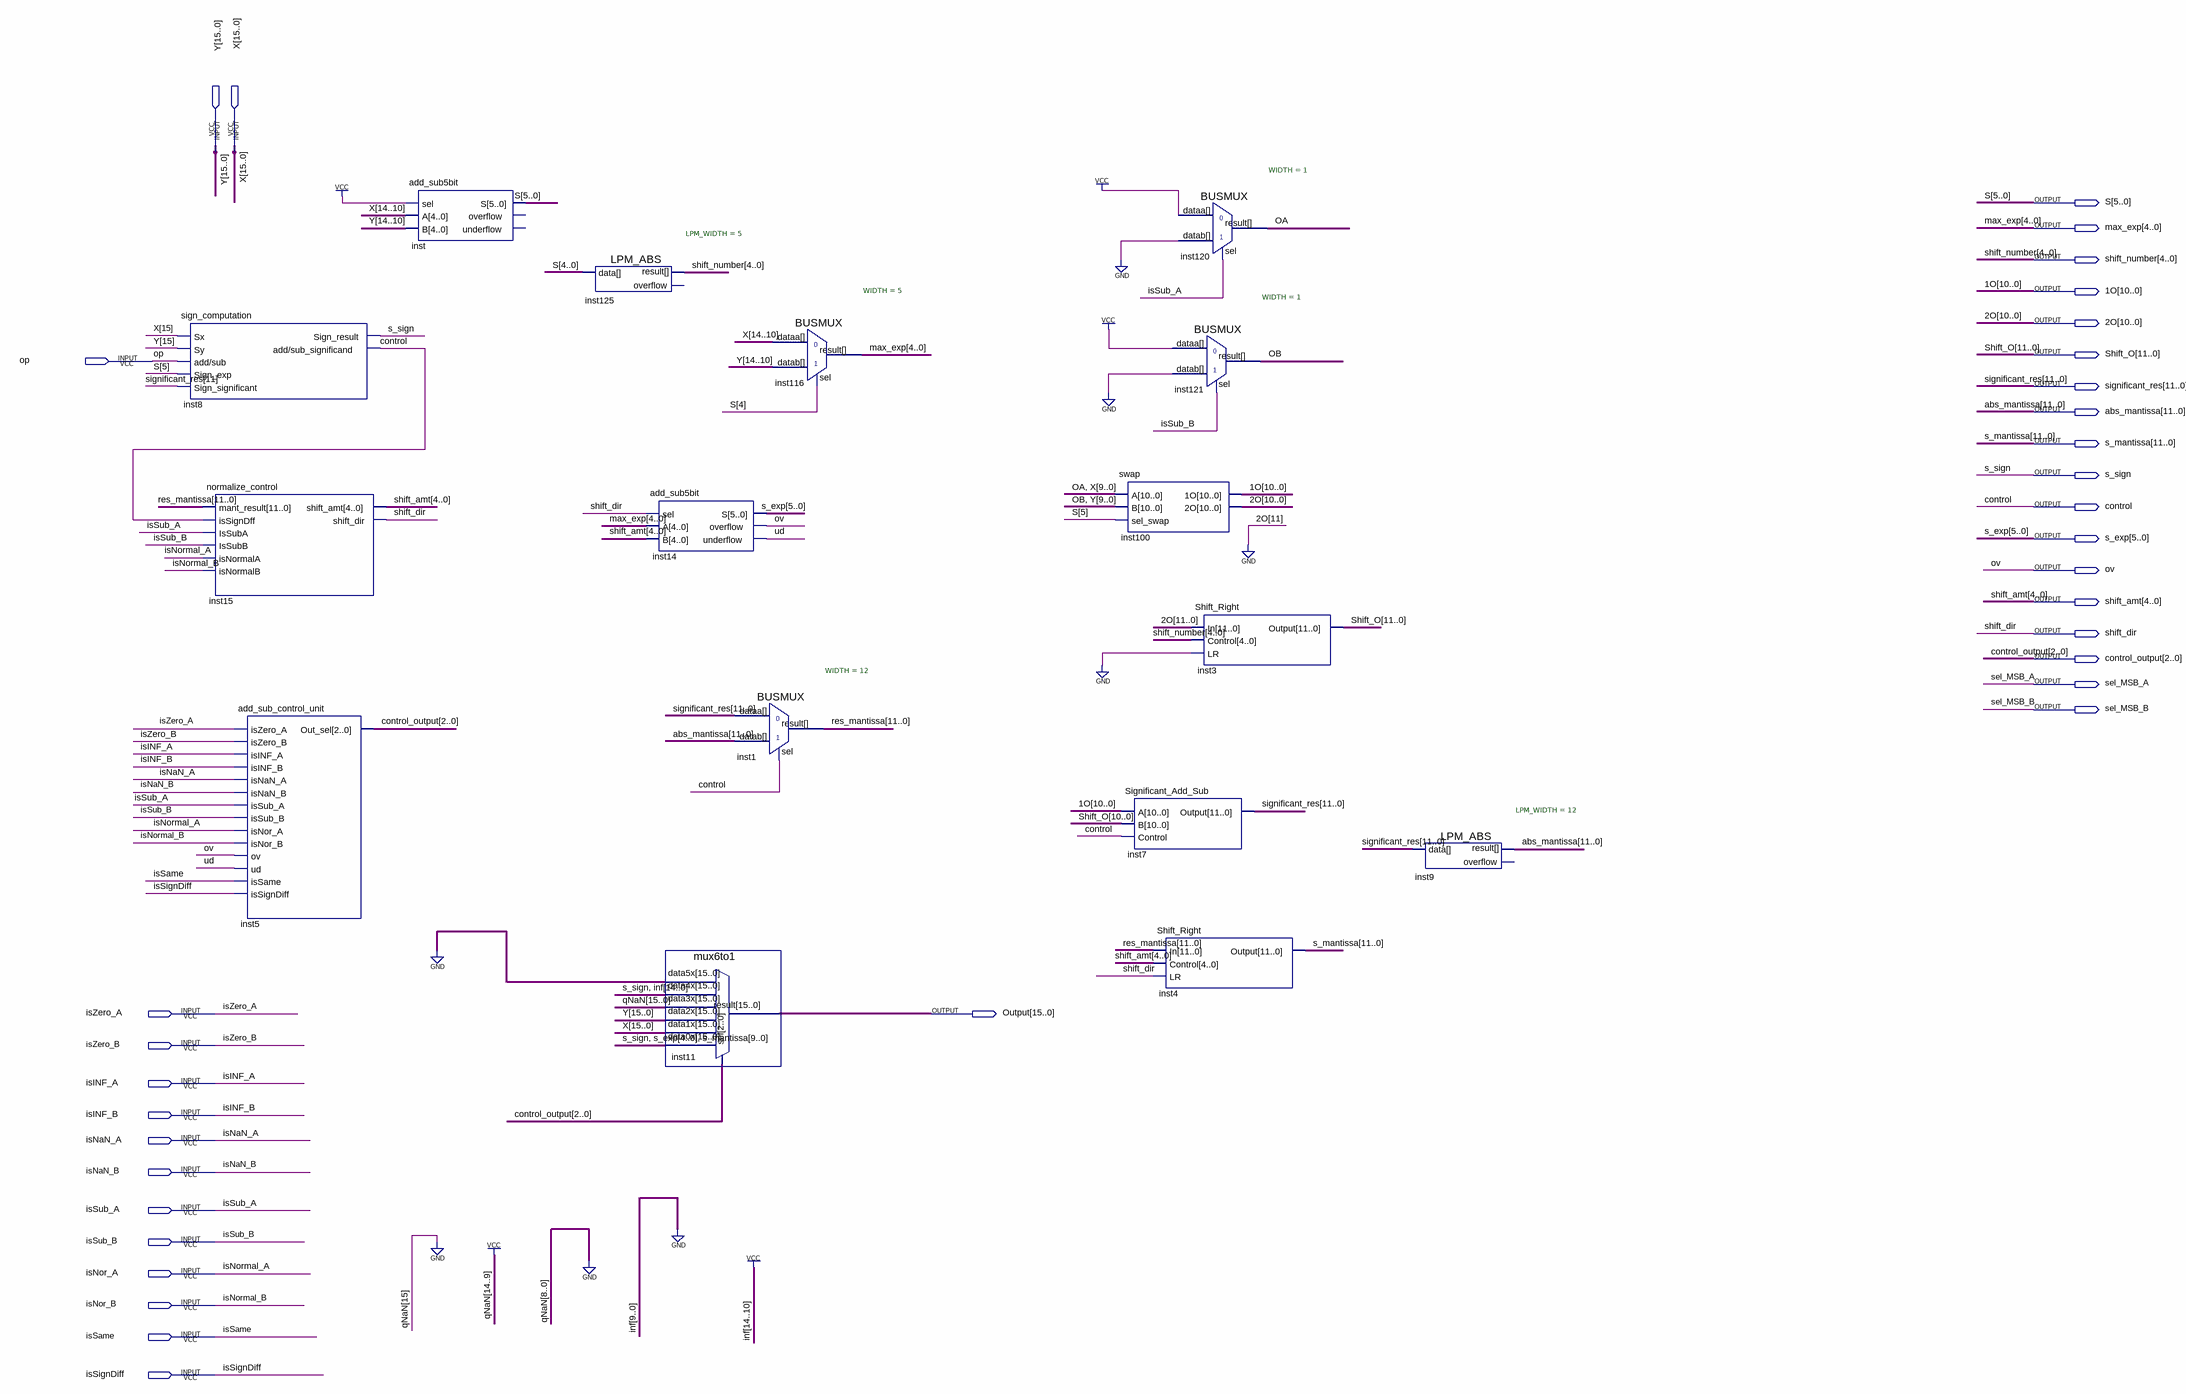
[diagram p0: schematic sheet]
// Quartus schematic FPU.bdf as structural Verilog: 16 symbols, 34 pins
module FPU (
  input  [15:0] Y,
  input  [15:0] X,
  input  op,
  input  isZero_A,
  input  isZero_B,
  input  isINF_A,
  input  isINF_B,
  input  isNaN_A,
  input  isNaN_B,
  input  isSub_A,
  input  isSub_B,
  input  isNor_A,
  input  isNor_B,
  input  isSame,
  input  isSignDiff,
  output [5:0] S,
  output [4:0] max_exp,
  output [4:0] shift_number,
  output [10:0] \1O ,
  output [10:0] \2O ,
  output [11:0] Shift_O,
  output [11:0] significant_res,
  output [11:0] abs_mantissa,
  output [11:0] s_mantissa,
  output s_sign,
  output control,
  output [5:0] s_exp,
  output ov,
  output [4:0] shift_amt,
  output shift_dir,
  output [2:0] control_output,
  output sel_MSB_A,
  output sel_MSB_B,
  output [15:0] Output
);

  wire OA, OB, ud;
  wire [11:0] res_mantissa;

  sign_computation inst8 (
    .Sx(X[15]), .Sy(Y[15]), .\add/sub (op), .Sign_exp(S[5]), .Sign_significant(significant_res[11]),
    .Sign_result(s_sign), .\add/sub_significand (control));
  normalize_control inst15 (
    .mant_result(res_mantissa), .isSignDff(control), .IsSubA(isSub_A), .IsSubB(isSub_B), .isNormalA(isNor_A),
    .isNormalB(isNor_B), .shift_amt(shift_amt), .shift_dir(shift_dir));
  add_sub_control_unit inst5 (
    .isZero_A(isZero_A), .isZero_B(isZero_B), .isINF_A(isINF_A), .isINF_B(isINF_B), .isNaN_A(isNaN_A),
    .isNaN_B(isNaN_B), .isSub_A(isSub_A), .isSub_B(isSub_B), .isNor_A(isNor_A), .isNor_B(isNor_B), .ov(ov),
    .ud(ud), .isSame(isSame), .isSignDiff(isSignDiff), .Out_sel(control_output));
  add_sub5bit inst (.sel(1'b1), .A(X[14:10]), .B(Y[14:10]), .S(S));  // open: overflow, underflow
  LPM_ABS #(.LPM_WIDTH(5)) inst125 (.data(S[4:0]), .result(shift_number));  // open: overflow
  add_sub5bit inst14 (.sel(shift_dir), .A(max_exp), .B(shift_amt), .S(s_exp), .overflow(ov), .underflow(ud));
  mux6to1 inst11 (
    .data5x({16{1'b0}}), .data4x({s_sign, 15'b111110000000000}), .data3x(16'b0111111000000000), .data2x(Y),
    .data1x(X), .data0x({s_sign, s_exp[4:0], s_mantissa[9:0]}), .sel(control_output), .result(Output));
  BUSMUX #(.WIDTH(12)) inst1 (.datab(abs_mantissa), .sel(control), .dataa(significant_res), .result(res_mantissa));
  BUSMUX #(.WIDTH(5)) inst116 (.datab(Y[14:10]), .sel(S[4]), .dataa(X[14:10]), .result(max_exp));
  swap inst100 (.A({OA, X[9:0]}), .B({OB, Y[9:0]}), .sel_swap(S[5]), .\1O (\1O ), .\2O (\2O ));
  Significant_Add_Sub inst7 (.A(\1O ), .B(Shift_O[10:0]), .Control(control), .Output(significant_res));
  BUSMUX #(.WIDTH(1)) inst120 (.datab(1'b0), .sel(isSub_A), .dataa(1'b1), .result(OA));
  BUSMUX #(.WIDTH(1)) inst121 (.datab(1'b0), .sel(isSub_B), .dataa(1'b1), .result(OB));
  Shift_Right inst3 (.In({1'b0, \2O }), .Control(shift_number), .LR(1'b0), .Output(Shift_O));
  Shift_Right inst4 (.In(res_mantissa), .Control(shift_amt), .LR(shift_dir), .Output(s_mantissa));
  LPM_ABS #(.LPM_WIDTH(12)) inst9 (.data(significant_res), .result(abs_mantissa));  // open: overflow

  // Other names for the same wires on the sheet: isNormal_A = isNor_A; isNormal_B = isNor_B
endmodule
